# Altium schematic sheet deel4.SchDoc
size A4; SheetNumber: 4; SheetTotal: 4
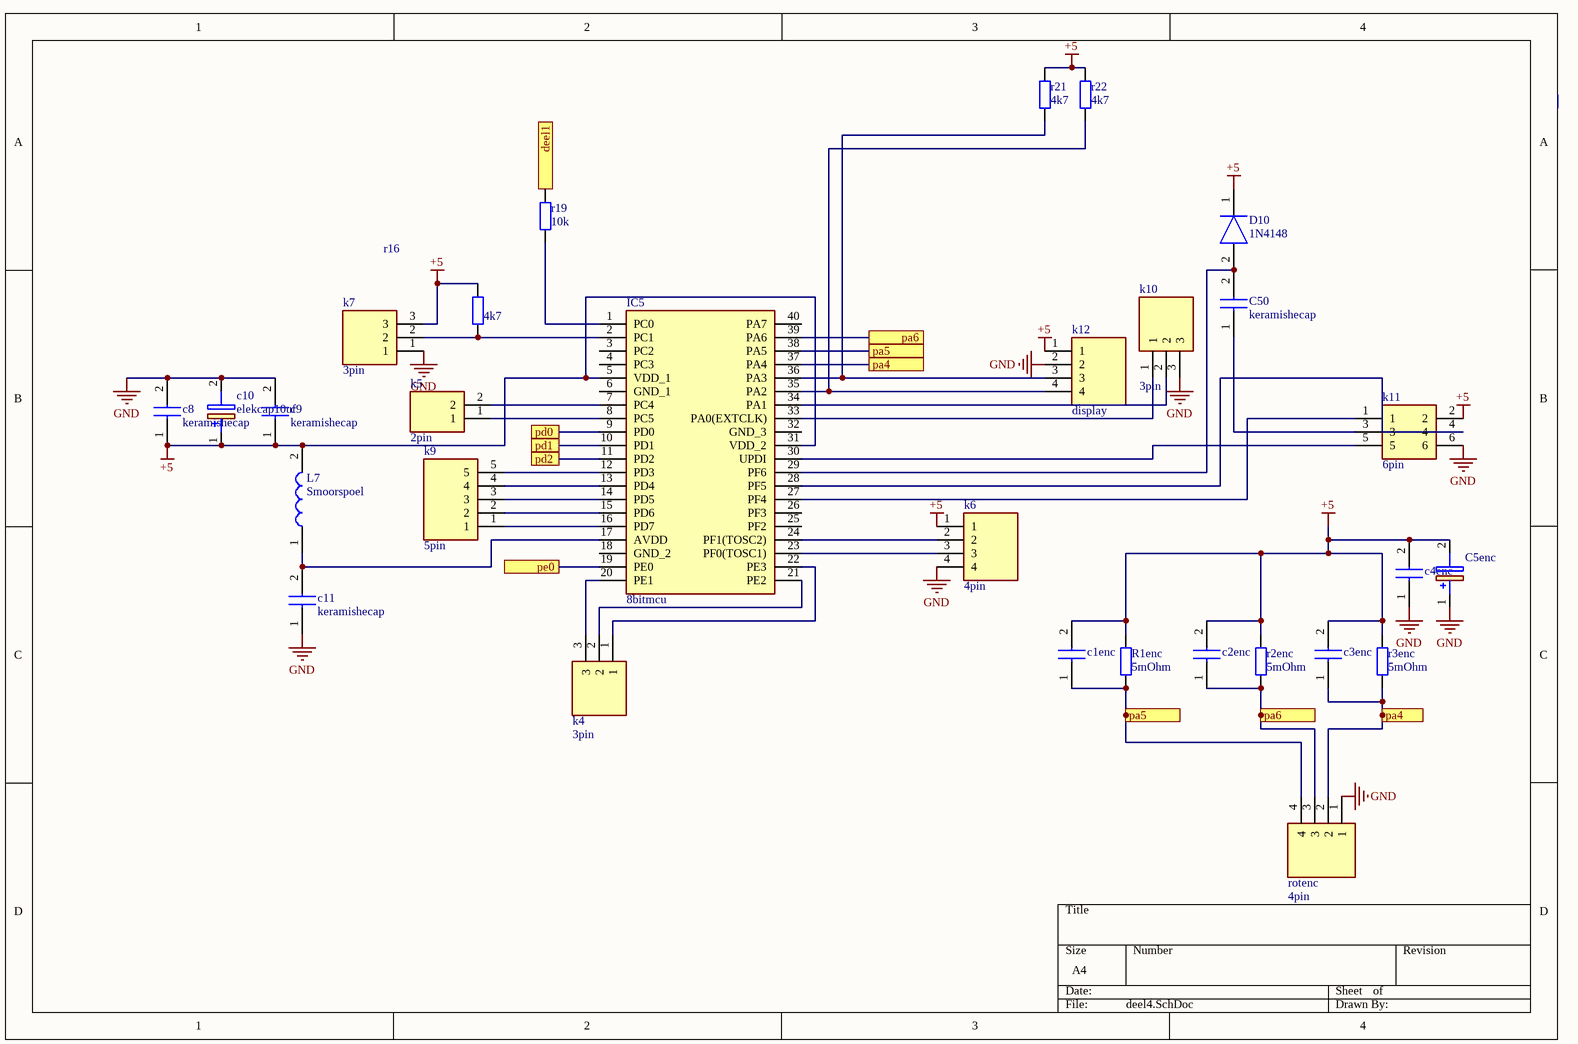
[diagram p0: deel4.SchDoc]

## Parts
c1enc  (no value)  [0805]
c2enc  (no value)  [0805]
c3enc  (no value)  [0805]
c4enc  (no value)  [0805]
C5enc  (no value)  [elekcap100uf]
c8  keramishecap  [0805]
c9  keramishecap  [0805]
c10  elekcap10uf  [elekcap10uf]
c11  keramishecap  [0805]
C50  keramishecap  [0805]
D10  1N4148  [diode1N4148]
IC5  8bitmcu  [8bitmcu]
k4  3pin  [3pin]
k5  2pin  [2pin]
k6  4pin  [4pin]
k7  3pin  [3pin]
k9  5pin  [5pin]
k10  3pin  [3pin]
k11  6pin  [6pin]
k12  display  [4pin]
L7  Smoorspoel  [Smoorspoel]
R1enc  5mOhm  [0805]
r2enc  5mOhm  [0805]
r3enc  5mOhm  [0805]
r16  4k7  [0805]
r19  10k  [0805]
r21  4k7  [0805]
r22  4k7  [0805]
rotenc  4pin  [4pin]

## Ports
deel1, pa4, pa5, pa6, pd0, pd1, pd2, pe0

## Nets
+5: c1enc.2 c2enc.2 c3enc.2 c4enc.2 C5enc.2(-) c8.1 c9.1 c10.1(+) D10.1(K) IC5.5(VDD_1) IC5.31(VDD_2) k6.1 k7.3 k11.2 k12.1 L7.2 R1enc.2 r2enc.2 r3enc.2 r16.2 r21.2 r22.2
GND: c4enc.1 C5enc.1(+) c8.2 c9.2 c10.2(-) c11.1 k6.4 k7.1 k10.3 k11.6 k12.2 rotenc.1
deel1: r19.2 ; port deel1
pa4: c3enc.1 IC5.37(PA4) r3enc.1 rotenc.2 ; port pa4
pa5: c1enc.1 IC5.38(PA5) R1enc.1 rotenc.4 ; port pa5
pa6: c2enc.1 IC5.39(PA6) r2enc.1 rotenc.3 ; port pa6
pd0: IC5.9(PD0) ; port pd0
pd1: IC5.10(PD1) ; port pd1
pd2: IC5.11(PD2) ; port pd2
pe0: IC5.19(PE0) ; port pe0
Netc11_2: c11.2 IC5.17(AVDD) L7.1
NetC50_1: C50.1 k11.3
NetC50_2: C50.2 D10.2(A) IC5.29(PF6)
NetIC5_1: IC5.1(PC0) r19.1
NetIC5_2: IC5.2(PC1) k7.2 r16.1
NetIC5_7: IC5.7(PC4) k5.2
NetIC5_8: IC5.8(PC5) k5.1
NetIC5_12: IC5.12(PD3) k9.5
NetIC5_13: IC5.13(PD4) k9.4
NetIC5_14: IC5.14(PD5) k9.3
NetIC5_15: IC5.15(PD6) k9.2
NetIC5_16: IC5.16(PD7) k9.1
NetIC5_20: IC5.20(PE1) k4.3
NetIC5_21: IC5.21(PE2) k4.2
NetIC5_22: IC5.22(PE3) k4.1
NetIC5_23: IC5.23(PF0(TOSC1)) k6.3
NetIC5_24: IC5.24(PF1(TOSC2)) k6.2
NetIC5_27: IC5.27(PF4) k11.1
NetIC5_28: IC5.28(PF5) k11.4
NetIC5_30: IC5.30(UPDI) k11.5
NetIC5_33: IC5.33(PA0(EXTCLK)) k10.1
NetIC5_34: IC5.34(PA1) k10.2
NetIC5_35: IC5.35(PA2) k12.4 r22.1
NetIC5_36: IC5.36(PA3) k12.3 r21.1

Not connected (* = marked no-connect by the designer): IC5 3(PC2) 4(PC3) 6(GND_1) 18(GND_2) 25(PF2) 26(PF3) 32(GND_3) 40(PA7)

## Library data of the parts
c1enc c2enc c3enc c4enc c8 c9 c11 C50 = keramishecap: Capacitor; Manufacturer_Name: Kemet; Manufacturer_Part_Number: C1206C104K3GACAUTO; Datasheet Link: https://www.kemet.com/specsheet/C1206C104K3GACAUTO; Height: 1.8mm
C5enc = elekcap100uf: Capacitor Polarised; Manufacturer_Name: Kemet; Manufacturer_Part_Number: ESH107M050AG3KA; Datasheet Link: https://connect.kemet.com:7667/gateway/IntelliData-ComponentDocumentation/1.0/download/specsheet/ESH107M050AG3KA; Height: 12.5mm
c10 = elekcap10uf: Capacitor Polarised; Manufacturer_Name: Panasonic; Manufacturer_Part_Number: EEU-FR1H100; Datasheet Link: https://componentsearchengine.com//EEU-FR1H100.pdf; Height: 12.5mm; Mouser2 Part Number: 667-EEU-FR1H100; Mouser2 Price/Stock: https://www.mouser.com/Search/Refine.aspx?Keyword=667-EEU-FR1H100
D10 = 1N4148: Diode; Manufacturer_Name: Nexperia; Datasheet Link: https://datasheet.datasheetarchive.com/originals/distributors/Datasheets-112/DSAP0040891.pdf; Manufacturer_Part_Number: 1N4148
IC5 = 8bitmcu: Integrated Circuit; Manufacturer_Name: Microchip; Manufacturer_Part_Number: ATMEGA4809-PF; Datasheet Link: https://componentsearchengine.com//ATMEGA4809-PF.pdf; Height: 6.35mm; Mouser2 Part Number: 556-ATMEGA4809-PF; Mouser2 Price/Stock: https://www.mouser.com/Search/Refine.aspx?Keyword=556-ATMEGA4809-PF
k4 k7 k10 = 3pin: Connector; Manufacturer_Name: Amphenol; Manufacturer_Part_Number: 10129378-903001BLF; Height: 8.58mm
k5 = 2pin: Connector; Manufacturer_Name: Amphenol; Manufacturer_Part_Number: 10129378-902001BLF; Datasheet Link: https://www.mouser.co.uk/datasheet/2/18/10129378-1530218.pdf; Height: 8.43mm
k6 k12 rotenc = 4pin: Connector; Manufacturer_Name: Amphenol; Manufacturer_Part_Number: 10129378-904001BLF; Datasheet Link: https://cdn.amphenol-icc.com/media/wysiwyg/files/drawing/10129378.pdf; Height: 8.58mm
k9 = 5pin: Connector; Manufacturer_Name: FCI Electronics; Manufacturer_Part_Number: 10129378-905001BLF; Datasheet Link: https://cdn.amphenol-icc.com/media/wysiwyg/files/drawing/10129378.pdf; Height: 8.58mm
k11 = 6pin: Connector; Manufacturer_Name: Amphenol; Manufacturer_Part_Number: 10129381-906002BLF; Datasheet Link: https://componentsearchengine.com//10129381-906002BLF.pdf; Height: 8.58mm; Mouser2 Part Number: 649-1012938190602BLF; Mouser2 Price/Stock: https://www.mouser.com/Search/Refine.aspx?Keyword=649-1012938190602BLF
L7 = Smoorspoel: Inductor; Manufacturer_Name: Murata Electronics; Manufacturer_Part_Number: LQM18FN1R0M00D; Datasheet Link: https://psearch.en.murata.com/inductor/product/LQM18FN1R0M00%23.html; Height: 0.9mm
R1enc r2enc r3enc r16 r19 r21 r22 = weerstand0805: WRIS-PSMB SMT Metal Plate Resistor, size 0805, 5mOhm, 0.5W; Manufacturer: Wurth Elektronik; Manufacturer Part Number: 580060720003; Rated Current: 10A; Temperature Coefficient of Resistance: +/-100ppm/degC; Technical Reference: MB0805R005F102KAATP0000; Resistance Tolerance: +/-1%; ComponentLink1Description: Manufacturer; ComponentLink1URL: http://www.we-online.de; ComponentLink2Description: Datasheet; ComponentLink2URL: https://www.we-online.com/catalog/datasheet/580060720003.pdf; Rated Power: 0.5W; Resistance: 5mOhm; Mounting Technology: SMT; Height: 0.35mm; Packaging: Tape and Reel; Published Date: May 2020; Size: 0805; Length: 2mm; Operating Temperature: -55 to +155degC; Width: 1.25mm